# Altium schematic sheet Sheet4550_1.SchDoc
size A4
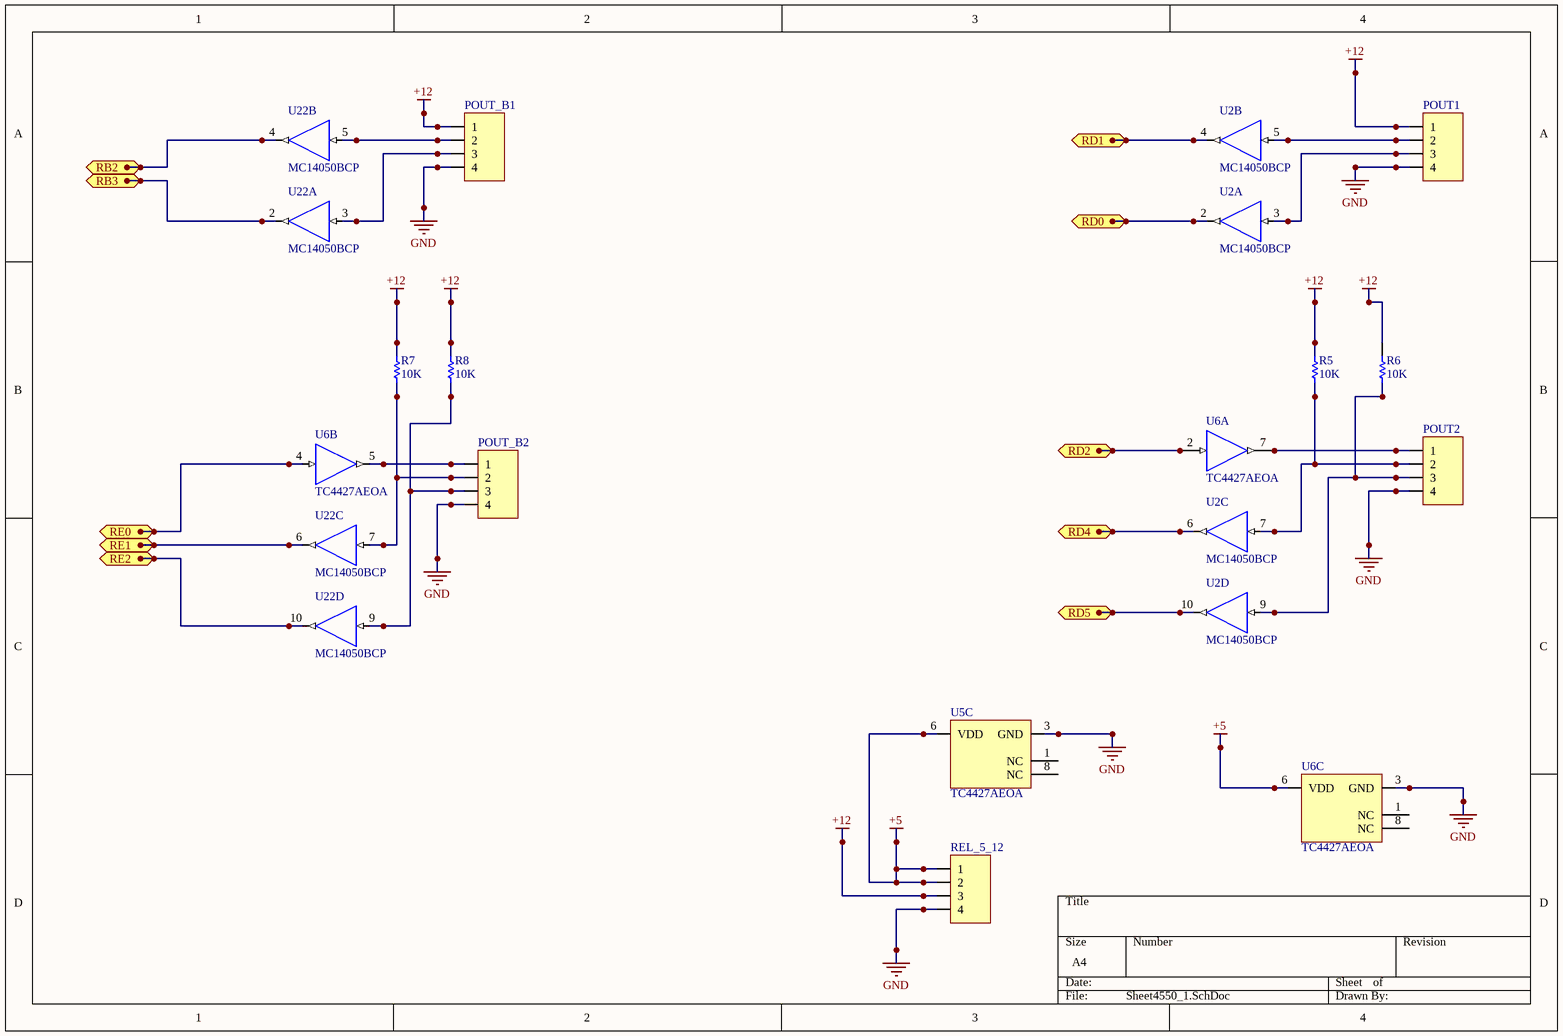
[diagram p0: Sheet4550_1.SchDoc]

## Parts
POUT1  Big1  [BIG4]  (value not drawn)
POUT2  Big1  [BIG4]  (value not drawn)
POUT_B1  Big1  [BIG4]  (value not drawn)
POUT_B2  Big1  [BIG4]  (value not drawn)
R5  10K  [RESC3216L]
R6  10K  [RESC3216L]
R7  10K  [RESC3216L]
R8  10K  [RESC3216L]
REL_5_12  Header 4  [HDR1X4]  (value not drawn)
U2  MC14050BCP  [648-08]  (parts A,B,C,D of 6)
U5  TC4427AEOA  [SOIC-OA8_N]  (part C of 3)
U6  TC4427AEOA  [SOIC-OA8_N]  (parts A,B,C of 3)
U22  MC14050BCP  [648-08]  (parts A,B,C,D of 6)

## Ports
RB2, RB3, RD0, RD1, RD2, RD4, RD5, RE0, RE1, RE2

## Nets
+5: REL_5_12.1 REL_5_12.2 U5.6(VDD) U6.6(VDD)
+12: POUT1.1 POUT_B1.1 R5.2 R6.2 R7.2 R8.2 REL_5_12.3
GND: POUT1.4 POUT2.4 POUT_B1.4 POUT_B2.4 REL_5_12.4 U2.8(GND) U5.3(GND) U6.3(GND) U22.8(GND)
VDD: U2.1(VDD) U22.1(VDD)
RB2: U22.4(OUT) ; port RB2
RB3: U22.2(OUT) ; port RB3
RD0: U2.2(OUT) ; port RD0
RD1: U2.4(OUT) ; port RD1
RD2: U6.2(INA) ; port RD2
RD4: U2.6(OUT) ; port RD4
RD5: U2.10(OUT) ; port RD5
RE0: U6.4(INB) ; port RE0
RE1: U22.6(OUT) ; port RE1
RE2: U22.10(OUT) ; port RE2
NetPOUT1_2: POUT1.2 U2.5(IN)
NetPOUT1_3: POUT1.3 U2.3(IN)
NetPOUT2_1: POUT2.1 U6.7(OUTA)
NetPOUT2_2: POUT2.2 R5.1 U2.7(IN)
NetPOUT2_3: POUT2.3 R6.1 U2.9(IN)
NetPOUT_B1_2: POUT_B1.2 U22.5(IN)
NetPOUT_B1_3: POUT_B1.3 U22.3(IN)
NetPOUT_B2_1: POUT_B2.1 U6.5(OUTB)
NetPOUT_B2_2: POUT_B2.2 R7.1 U22.7(IN)
NetPOUT_B2_3: POUT_B2.3 R8.1 U22.9(IN)

Not connected (* = marked no-connect by the designer): U5 1(NC) 8(NC); U6 1(NC) 8(NC)

## Library data of the parts
POUT1 POUT2 POUT_B1 POUT_B2 REL_5_12 = Header 4: Header, 4-Pin; LatestRevisionDate: 17-Jul-2002; LatestRevisionNote: Re-released for DXP Platform.; Publisher: Altium Limited
R5-R8 = Res Semi: Semiconductor Resistor; Published: 8-Jun-2000; LatestRevisionDate: 17-Jul-2002; LatestRevisionNote: Re-released for DXP Platform.; PackageReference: AXIAL-0.5; Publisher: Altium Limited; Value: 10K
U2 U22 = MC14050BCP: Hex Non-Inverting Buffer; Note: NC Pins are 13,16; Published: 15-Apr-2002; DatasheetVersion: 1995; PackageVersion: Apr-2000; PackageReference: 648-08; Publisher: Altium Limited; PackageDescription: DIP; 16 Leads; Row Spacing 7.62 mm; Pitch 2.54 mm; Code_JEDEC: MS-001-BB; ComponentLink1Description: Manufacturer Link; ComponentLink1URL: http://www.onsemi.com/; ComponentLink2Description: Datasheet; ComponentLink2URL: http://www.onsemi.com/pub/Collateral/MC14049B-D.PDF
U5 U6 = TC4427AEOA: 1.5A Dual High-Speed Power MOSFET Driver, Non-Inverting, Industrial Temperature; FirstPublished: 29-Jan-2009; DatasheetVersion: revF, Jan-2006; PackageVersion: revBB, Aug-2009; PackageReference: SOIC-OA8; Publisher: Altium Limited; PackageDescription: 8-Lead Plastic Small Outline (OA) - Narrow, 3.90mm Body [SOIC]; Supplier 1: Digi-Key; Supplier Part Number 1: TC4427AEOA-ND; Supplier 2: Farnell; Supplier Part Number 2: 1292285; Supplier 3: Newark; Supplier Part Number 3: 96K4020; Code_IPC: SOIC127P600-8; ComponentLink1Description: Datasheet; ComponentLink1URL: http://ww1.microchip.com/downloads/en/DeviceDoc/21423F.pdf; ComponentLink2Description: Packaging Specification; ComponentLink2URL: http://www.microchip.com/stellent/groups/techpub_sg/documents/packagingspec/en012702.pdf; ComponentLink3Description: Microchip.com Home; ComponentLink3URL: http://www.microchip.com/